# EAGLE schematic Mosfet_addon_Board (EAGLE 6.6.0)
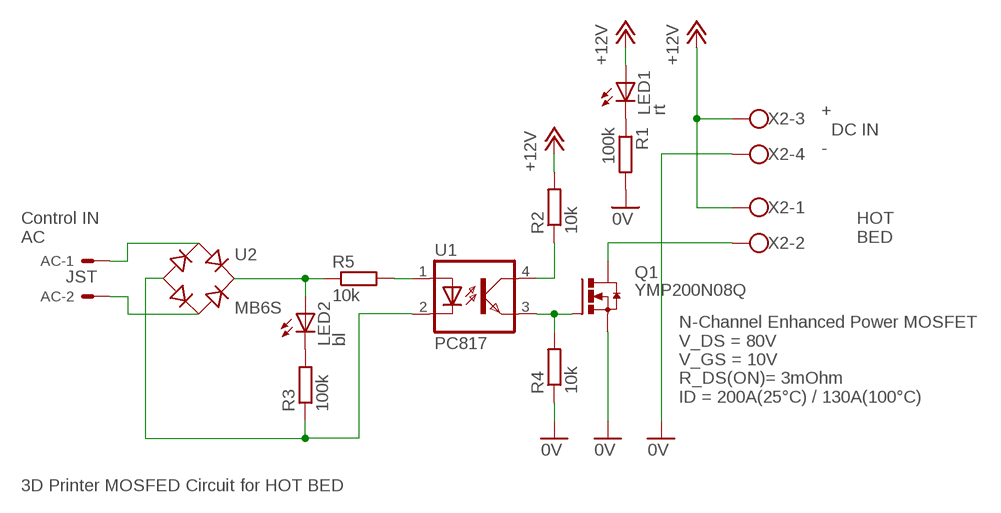
[diagram p0: schematic, sheet 1]

## Parts
AC  JST  JST-XH-02-PIN-LONG-PAD  [JST-XH-02-PACKAGE-LONG-PAD]
LED1  rt  LEDCHIP-LED0805  [CHIP-LED0805]
LED2  bl  LEDCHIP-LED0805  [CHIP-LED0805]
Q1  YMP200N08Q  IRFP240  [TO247BV]
R1  100k  R-EU_R0805  [R0805]
R2  10k  R-EU_R0805  [R0805]
R3  100k  R-EU_R0805  [R0805]
R4  10k  R-EU_R0805  [R0805]
R5  10k  R-EU_R0805  [R0805]
U1  PC817  [DIL04]
U2  MB6S  [SOIC-4]
X2  W237-4  [W237-4]

## Nets
0V: Q1.S R1.2 R4.1 X2.4
+12V: LED1.A R2.2 X2.1 X2.3
N$1: AC.1 U2.~1(AC1)
N$2: AC.2 U2.~2(AC2)
N$3: LED2.C R3.2
N$4: LED2.A R5.1 U2.+
N$5: R3.1 U1.2(C) U2.-
N$7: LED1.C R1.1
N$9: R2.1 U1.4(COL)
N$10: Q1.G R4.2 U1.3(EMIT)
N$11: R5.2 U1.1(A)
N$12: Q1.D X2.2

## Notes on the sheet
- +
    DC IN
  -
- Control IN
  AC
- HOT
  BED
- N-Channel Enhanced Power MOSFET
  V_DS = 80V
  V_GS = 10V
  R_DS(ON)= 3mOhm
  ID = 200A(25°C) / 130A(100°C)
- 3D Printer MOSFED Circuit for HOT BED

## Library data of the parts
AC = Rembrandt Electronics - JST XH Connectors v1-0:JST-XH-02-PIN: JST XH Connector 2 Pin Wire to board connector. Pitch: 2,54 mm, (0.100") Number of pins: 2 Created by Rembrandt Electronics www.rembrandtelectronics.com
LED1 LED2 = led:LED: LED OSRAM: - CHIPLED LG R971, LG N971, LY N971, LG Q971, LY Q971, LO R971, LY R971 LH N974, LH R974 LS Q976, LO Q976, LY Q976 LO Q996 - Hyper CHIPLED LW Q18S LB Q993, LB Q99A, LB R99A - SideLED LS A670, LO A670, LY A670, LG A670, LP A670 LB A673, LV A673, LT A673, LW A673 LH A674 LY A675 LS A676, LA A676, LO A676, LY A676, LW A676 LS A679, LY A679, LG A679 - Hyper Micro SIDELED® LS Y876, LA Y876, LO Y876, LY Y876 LT Y87S - SmartLED LW L88C, LW L88S LB L89C, LB L89S, LG L890 LS L89K, LO L89K, LY L89K LS L896, LA L896, LO L896, LY L896 - TOPLED LS T670, LO T670, LY T670, LG T670, LP T670 LSG T670, LSP T670, LSY T670, LOP T670, LYG T670 LG T671, LOG T671, LSG T671 LB T673, LV T673, LT T673, LW T673 LH T674 LS T676, LA T676, LO T676, LY T676, LB T676, LH T676, LSB T676, LW T676 LB T67C, LV T67C, LT T67C, LS T67K, LO T67K, LY T67K, LW E67C LS E67B, LA E67B, LO E67B, LY E67B, LB E67C, LV E67C, LT E67C LW T67C LS T679, LY T679, LG T679 LS T770, LO T770, LY T770, LG T770, LP T770 LB T773, LV T773, LT T773, LW T773 LH T774 LS E675, LA E675, LY E675, LS T675 LS T776, LA T776, LO T776, LY T776, LB T776 LHGB T686 LT T68C, LB T68C - Hyper Mini TOPLED® LB M676 - Mini TOPLED Santana® LG M470 LS M47K, LO M47K, LY M47K Source: http://www.osram.convergy.de LUXEON: - LUMILED® LXK2-PW12-R00, LXK2-PW12-S00, LXK2-PW14-U00, LXK2-PW14-V00 LXK2-PM12-R00, LXK2-PM12-S00, LXK2-PM14-U00 LXK2-PE12-Q00, LXK2-PE12-R00, LXK2-PE12-S00, LXK2-PE14-T00, LXK2-PE14-U00 LXK2-PB12-K00, LXK2-PB12-L00, LXK2-PB12-M00, LXK2-PB14-N00, LXK2-PB14-P00, LXK2-PB14-Q00 LXK2-PR12-L00, LXK2-PR12-M00, LXK2-PR14-Q00, LXK2-PR14-R00 LXK2-PD12-Q00, LXK2-PD12-R00, LXK2-PD12-S00 LXK2-PH12-R00, LXK2-PH12-S00 LXK2-PL12-P00, LXK2-PL12-Q00, LXK2-PL12-R00 Source: www.luxeon.com KINGBRIGHT: KA-3528ASYC Source: www.kingbright.com
Q1 = transistor-power:IRFP240: HEXFET Power MosFet Source: http://www.irf.com/
R1-R5 = rcl:R-EU_: RESISTOR, European symbol
U1 = optocoupler:PC817: SHARP OPTO COUPLER; MPN: PC817X4J000F; OC_FARNELL: 9707727; OC_NEWARK: 97K7059
U2 = rectifier:MB*S: Bridge Rectifier Source: http://www.fairchildsemi.com/ds/MB/MB6S.pdf
X2 = con-wago-500:W237-4: WAGO SCREW CLAMP; OC_FARNELL: unknown; OC_NEWARK: unknown